# Altium schematic sheet mainboard_motor.v1.2.SchDoc
size A4
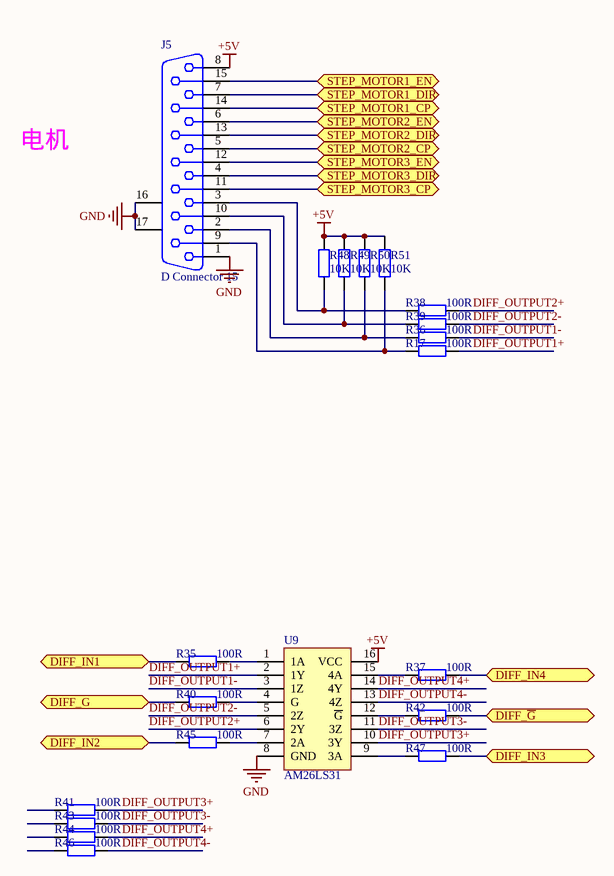
[diagram p0: mainboard_motor.v1.2.SchDoc]

## Parts
J5  D Connector 15  [DSUB1.385-2H15]
R17  100R  [0805]
R35  100R  [0805]
R36  100R  [0805]
R37  100R  [0805]
R38  100R  [0805]
R39  100R  [0805]
R40  100R  [0805]
R41  100R  [0805]
R42  100R  [0805]
R43  100R  [0805]
R44  100R  [0805]
R45  100R  [0805]
R46  100R  [0805]
R47  100R  [0805]
R48  10K  [0805]
R49  10K  [0805]
R50  10K  [0805]
R51  10K  [0805]
U9  AM26LS31  [SO-16]

## Ports
DIFF_G, DIFF_IN1, DIFF_IN2, DIFF_IN3, DIFF_IN4, DIFF_~{G}, STEP_MOTOR1_CP, STEP_MOTOR1_DIR, STEP_MOTOR1_EN, STEP_MOTOR2_CP, STEP_MOTOR2_DIR, STEP_MOTOR2_EN, STEP_MOTOR3_CP, STEP_MOTOR3_DIR, STEP_MOTOR3_EN

## Nets
+5V: J5.8 R48.1 R49.1 R50.1 R51.1 U9.16(VCC)
GND: J5.1 J5.16(MH1) J5.17(MH2) U9.8(GND)
DIFF_G: R40.2 ; port DIFF_G
DIFF_~{G}: R42.1 ; port DIFF_~{G}
DIFF_IN1: R35.2 ; port DIFF_IN1
DIFF_IN2: R45.2 ; port DIFF_IN2
DIFF_IN3: R47.1 ; port DIFF_IN3
DIFF_IN4: R37.1 ; port DIFF_IN4
DIFF_OUTPUT1+: R17.1 U9.2(1Y)
DIFF_OUTPUT1-: R36.1 U9.3(1Z)
DIFF_OUTPUT2+: R38.1 U9.6(2Y)
DIFF_OUTPUT2-: R39.1 U9.5(2Z)
DIFF_OUTPUT3+: R41.1 U9.10(3Y)
DIFF_OUTPUT3-: R43.1 U9.11(3Z)
DIFF_OUTPUT4+: R44.1 U9.14(4Y)
DIFF_OUTPUT4-: R46.1 U9.13(4Z)
STEP_MOTOR1_CP: J5.14 ; port STEP_MOTOR1_CP
STEP_MOTOR1_DIR: J5.7 ; port STEP_MOTOR1_DIR
STEP_MOTOR1_EN: J5.15 ; port STEP_MOTOR1_EN
STEP_MOTOR2_CP: J5.5 ; port STEP_MOTOR2_CP
STEP_MOTOR2_DIR: J5.13 ; port STEP_MOTOR2_DIR
STEP_MOTOR2_EN: J5.6 ; port STEP_MOTOR2_EN
STEP_MOTOR3_CP: J5.11 ; port STEP_MOTOR3_CP
STEP_MOTOR3_DIR: J5.4 ; port STEP_MOTOR3_DIR
STEP_MOTOR3_EN: J5.12 ; port STEP_MOTOR3_EN
NetJ5_2: J5.2 R36.2 R50.2
NetJ5_3: J5.3 R38.2 R48.2
NetJ5_9: J5.9 R17.2 R51.2
NetJ5_10: J5.10 R39.2 R49.2
NetR35_1: R35.1 U9.1(1A)
NetR37_2: R37.2 U9.15(4A)
NetR40_1: R40.1 U9.4(G)
NetR42_2: R42.2 U9.12(~{G})
NetR45_1: R45.1 U9.7(2A)
NetR47_2: R47.2 U9.9(3A)

Not connected (* = marked no-connect by the designer): R41 2; R43 2; R44 2; R46 2

## Notes on the sheet
- 电机

## Library data of the parts
J5 = D Connector 15: Receptacle Assembly, 15 Position, Right Angle; PackageDocument: O; Positions: 15; Published: 15-Jun-2001; LatestRevisionDate: 17-Jul-2002; LatestRevisionNote: Re-released for DXP Platform.; DatasheetDocument: 1-Sep-99; PackageReference: 788757; Publisher: Altium Limited; Orientation: Right Angle; Gender: Receptacle
R17 R35-R51 = Res2: Resistor; Value: 1K; Published: 8-Jun-2000; LatestRevisionDate: 17-Jul-2002; LatestRevisionNote: Re-released for DXP Platform.; PackageReference: AXIAL-0.4; Publisher: Altium Limited